# Altium schematic sheet Main.SchDoc
size A3; SheetNumber: 2; SheetTotal: 2
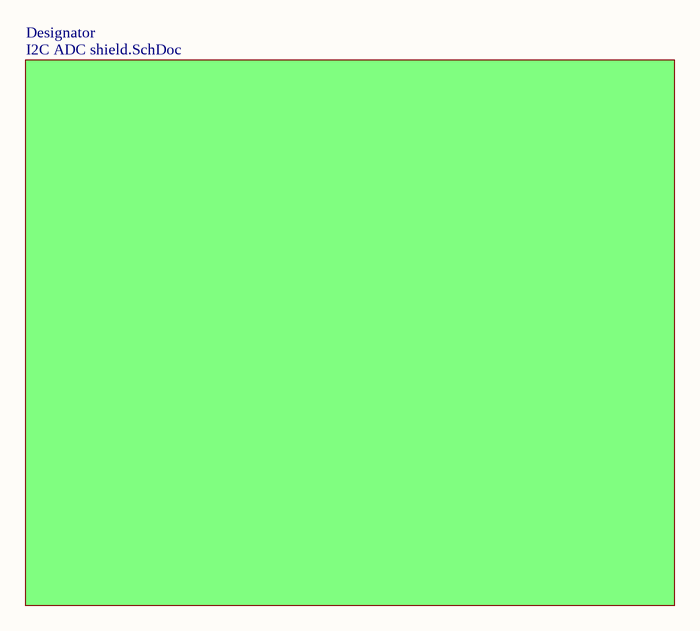
[diagram p0: Main.SchDoc]

## Sub-sheets
Designator = I2C ADC shield.SchDoc: no entries